# Altium schematic sheet Motherboard.SchDoc
size A4; SheetNumber: 2; SheetTotal: 2
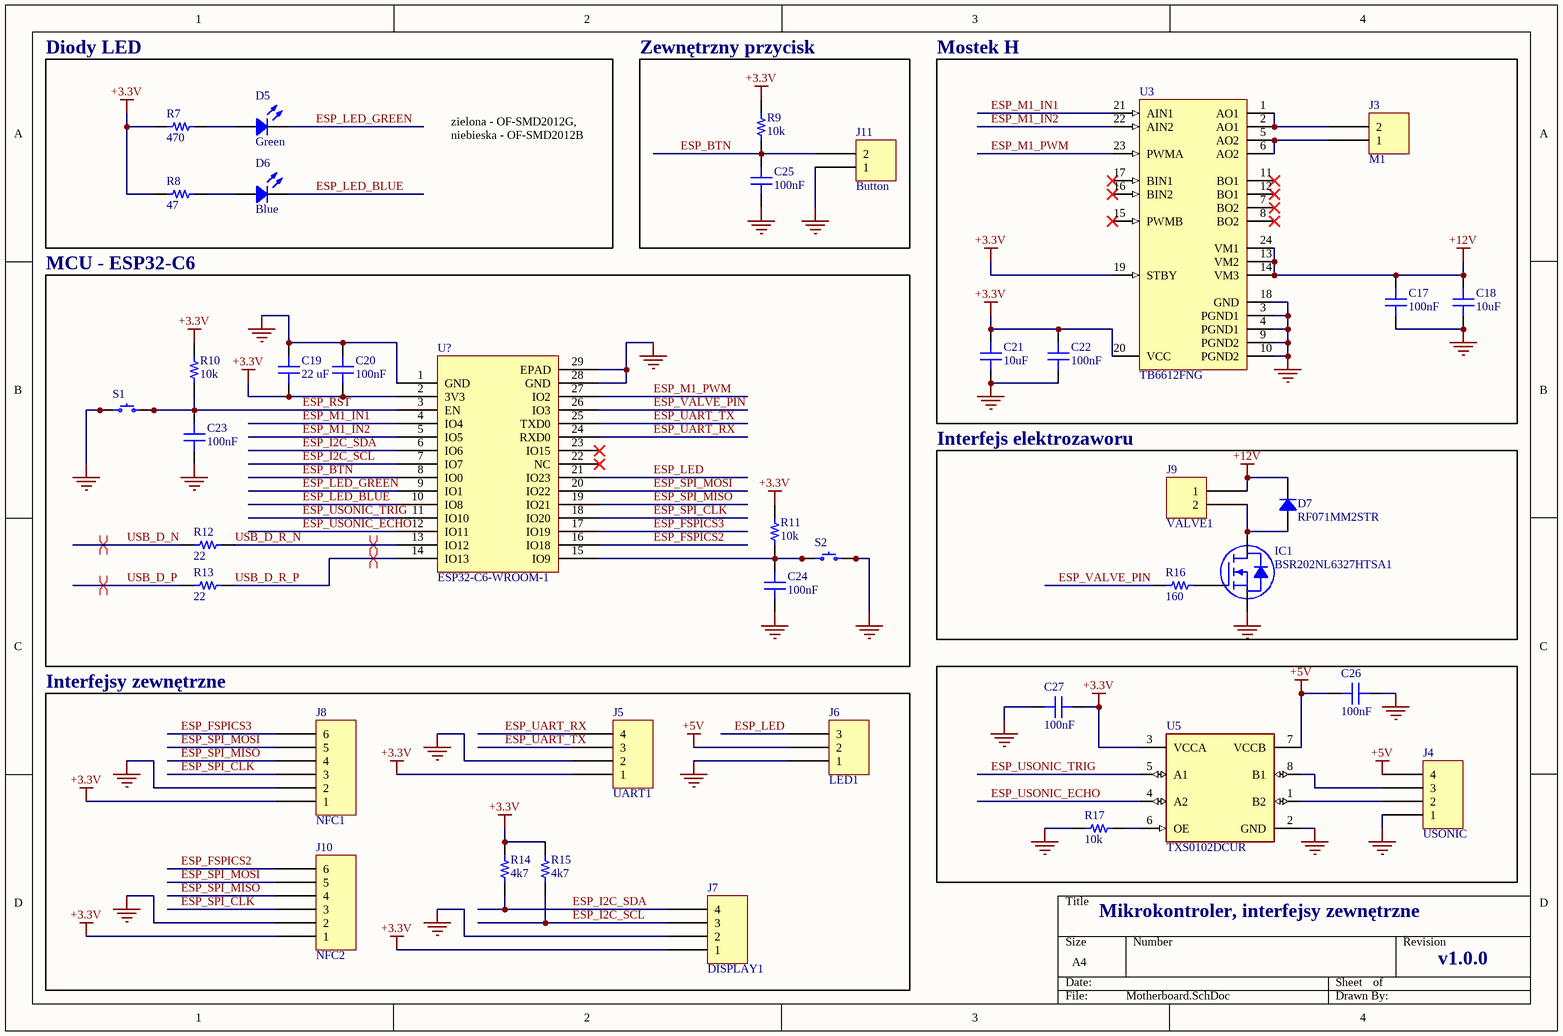
[diagram p0: Motherboard.SchDoc]

## Parts
C17  Capacitance: 100nF  [CAP 0805_2012]  (hidden comment: 0.1 µF)
C18  Capacitance: 10uF  [CAP 0805_2012]  (hidden comment: 10 µF)
C19  Capacitance: 22 uF  [CAP 0805_2012]  (hidden comment: 22 µF)
C20  Capacitance: 100nF  [CAP 0805_2012]  (hidden comment: 0.1 µF)
C21  Capacitance: 10uF  [CAP 0805_2012]  (hidden comment: 10 µF)
C22  Capacitance: 100nF  [CAP 0805_2012]  (hidden comment: 0.1 µF)
C23  Capacitance: 100nF  [CAP 0805_2012]  (hidden comment: 0.1 µF)
C24  Capacitance: 100nF  [CAP 0805_2012]  (hidden comment: 0.1 µF)
C25  Capacitance: 100nF  [CAP 0805_2012]  (hidden comment: 0.1 µF)
C26  Capacitance: 100nF  [CAP 0805_2012]  (hidden comment: 0.1 µF)
C27  Capacitance: 100nF  [CAP 0805_2012]  (hidden comment: 0.1 µF)
D5  Green  [LED 0805_2012 GREEN]
D6  Blue  [LED 0805_2012 BLUE]
D7  RF071MM2STR  [SOD123F]
IC1  BSR202NL6327HTSA1  [INFINEON SOT-23-3]
J3  M1  [MOLEX KK 0022272021]
J4  USONIC  [MOLEX KK 0022272041]
J5  UART1  [MOLEX KK 0022272041]
J6  LED1  [MOLEX KK 0022272031]
J7  DISPLAY1  [MOLEX KK 0022272041]
J8  NFC1  [MOLEX KK 0022272061]
J9  VALVE1  [MOLEX KK 0022272021]
J10  NFC2  [MOLEX KK 0022272061]
J11  Button  [MOLEX KK 0022272021]
R7  470  [RES 0805_2012]
R8  47  [RES 0805_2012]
R9  10k  [RES 0805_2012]
R10  10k  [RES 0805_2012]
R11  10k  [RES 0805_2012]
R12  22  [RES 0805_2012]
R13  22  [RES 0805_2012]
R14  4k7  [RES 0805_2012]
R15  4k7  [RES 0805_2012]
R16  160  [YAGEO RES 0805_2012]
R17  10k  [RES 0805_2012]
S1  FSM6JSMAASTR  [TE FSM6JSMA]  (value not drawn)
S2  FSM6JSMAASTR  [TE FSM6JSMA]  (value not drawn)
U3  TB6612FNG  [TOSH-SSOP-24_M]
U4  ESP32-C6-WROOM-1  [ESP32-C6-WROOM1]
U5  TXS0102DCUR  [FP-DCU0008A-MFG]

## Blocks framed on the sheet
Diody LED: D5 D6 R7 R8
Zewnętrzny przycisk: C25 J11 R9
Mostek H: C17 C18 C21 C22 J3 U3
MCU - ESP32-C6: C19 C20 C23 C24 R10-R13 S1 S2 U4
Interfejs elektrozaworu: D7 IC1 J9 R16
Interfejsy zewnętrzne: J5-J8 J10 R14 R15

## Nets
+3.3V: C19.1 C20.1 C21.2 C22.1 C27.2 J5.1 J7.1 J8.1 J10.1 R7.1 R8.1 R9.2 R10.2 R11.2 R14.2 R15.2 U3.19(STBY) U3.20(VCC) U4.2(3V3) U5.3(VCCA)
+5V: C26.1 J4.4 J6.2 U5.7(VCCB)
+12V: C17.1 C18.2 D7.2 J9.1 U3.13(VM2) U3.14(VM3) U3.24(VM1)
GND: C17.2 C18.1 C19.2 C20.2 C21.1 C22.2 C23.1 C24.1 C25.1 C26.2 C27.1 IC1.2(S) J4.1 J5.2 J6.1 J7.2 J8.2 J10.2 J11.1 R17.1 S1.1 S1.2 S2.3 S2.4 U3.3(PGND1) U3.4(PGND1) U3.9(PGND2) U3.10(PGND2) U3.18(GND) U4.1(GND) U4.28(GND) U4.29(EPAD) U5.2(GND)
ESP_BTN: C25.2 J11.2 R9.1 U4.8(IO0)
ESP_FSPICS2: J10.6 U4.16(IO18)
ESP_FSPICS3: J8.6 U4.17(IO19)
ESP_I2C_SCL: J7.3 R15.1 U4.7(IO7)
ESP_I2C_SDA: J7.4 R14.1 U4.6(IO6)
ESP_LED: J6.3 U4.21(IO23)
ESP_LED_BLUE: D6.2 U4.10(IO8)
ESP_LED_GREEN: D5.2 U4.9(IO1)
ESP_M1_IN1: U3.21(AIN1) U4.4(IO4)
ESP_M1_IN2: U3.22(AIN2) U4.5(IO5)
ESP_M1_PWM: U3.23(PWMA) U4.27(IO2)
ESP_RST: C23.2 R10.1 S1.3 S1.4 U4.3(EN)
ESP_SPI_CLK: J8.3 J10.3 U4.18(IO20)
ESP_SPI_MISO: J8.4 J10.4 U4.19(IO21)
ESP_SPI_MOSI: J8.5 J10.5 U4.20(IO22)
ESP_UART_RX: J5.4 U4.24(RXD0)
ESP_UART_TX: J5.3 U4.25(TXD0)
ESP_USONIC_ECHO: U4.12(IO11) U5.4(A2)
ESP_USONIC_TRIG: U4.11(IO10) U5.5(A1)
ESP_VALVE_PIN: R16.1 U4.26(IO3)
USB_D_N: R12.1
USB_D_P: R13.1
USB_D_R_N: R12.2 U4.13(IO12)
USB_D_R_P: R13.2 U4.14(IO13)
NetC24_2: C24.2 R11.1 S2.1 S2.2 U4.15(IO9)
NetD5_1: D5.1 R7.2
NetD6_1: D6.1 R8.2
NetD7_1: D7.1 IC1.3(D) J9.2
NetIC1_1: IC1.1(G) R16.2
NetJ3_1: J3.1 U3.5(AO2) U3.6(AO2)
NetJ3_2: J3.2 U3.1(AO1) U3.2(AO1)
NetJ4_2: J4.2 U5.1(B2)
NetJ4_3: J4.3 U5.8(B1)
NetR17_2: R17.2 U5.6(OE)

Not connected (* = marked no-connect by the designer): U3 7(BO2)* 8(BO2)* 11(BO1)* 12(BO1)* 15(PWMB)* 16(BIN2)* 17(BIN1)*; U4 22(NC)* 23(IO15)*

## Layout directives
differential pair: USB_D_N, USB_D_P, USB_D_R_N, USB_D_R_P

## Notes on the sheet
- zielona - OF-SMD2012G, niebieska - OF-SMD2012B
- Mikrokontroler, interfejsy zewnętrzne
- v1.0.0
- (in symbol ESP32-C6-WROOM-1) U?

## Library data of the parts
C17 C20 C22-C27 = CC0805MRX7R9BB104: CAP CER 0.1UF 50V X7R 0805; manufacturer: Yageo; Tolerance: ±20%; Part Number: CC0805MRX7R9BB104; Applications: General Purpose; componentlink1description: Datasheet; componentlink1url: https://www.yageo.com/upload/media/product/productsearch/datasheet/mlcc/UPY-GPHC_X7R_6.3V-to-50V_18.pdf; componentlink2description: DigiKey Link; componentlink2url: https://www.digikey.com/en/products/detail/yageo/CC0805MRX7R9BB104/5884281; Device Package: 0805 (2012 Metric); lastupdated: 09/02/2024 20:16:09; Lifecycle Status: Active; Minimum Order: 1; Mounting Type: Surface Mount, MLCC; Operating Temperature: -55°C ~ 125°C; Package / Case: 0805 (2012 Metric); packaging: TapeAndReel; partid: 2475; Part Status: Active; price: 0.01; series: CC; Size / Dimension: 0.079" L x 0.049" W (2.00mm x 1.25mm); Supplier 1: DigiKey; Supplier Part Number 1: 311-4351-1-ND; Temperature Coefficient: X7R; Thickness (Max): 0.037" (0.95mm); value: 0.1 µF; Voltage - Rated: 50V
C18 C21 = C2012X6S1C106K125AC: CAP CER 10UF 16V X6S 0805; manufacturer: TDK Corporation; Tolerance: ±10%; Part Number: C2012X6S1C106K125AC; Applications: General Purpose; componentlink1description: Datasheet; componentlink1url: https://product.tdk.com/info/en/catalog/datasheets/mlcc_commercial_general_en.pdf?ref_disty=digikey; componentlink2description: DigiKey Link; componentlink2url: https://www.digikey.com/en/products/detail/tdk-corporation/C2012X6S1C106K125AC/2733046; Device Package: 0805 (2012 Metric); Features: Low ESL; lastupdated: 09/02/2024 20:16:08; Lifecycle Status: Active; Minimum Order: 1; Mounting Type: Surface Mount, MLCC; Operating Temperature: -55°C ~ 105°C; Package / Case: 0805 (2012 Metric); packaging: TapeAndReel; partid: 2995; Part Status: Active; price: 0.06; series: C; Size / Dimension: 0.079" L x 0.049" W (2.00mm x 1.25mm); Supplier 1: DigiKey; Supplier Part Number 1: 445-7611-1-ND; Temperature Coefficient: X6S; Thickness (Max): 0.057" (1.45mm); value: 10 µF; Voltage - Rated: 16V
C19 = CL21A226KOQNNNG: CAP CER 22UF 16V X5R 0805; manufacturer: Samsung Electro-Mechanics; Tolerance: ±10%; Part Number: CL21A226KOQNNNG; Applications: General Purpose; componentlink1description: Datasheet; componentlink1url: //media.digikey.com/pdf/Data%20Sheets/Samsung%20PDFs/CL21A226KOQNNNG_Spec.pdf; componentlink2description: DigiKey Link; componentlink2url: https://www.digikey.com/en/products/detail/samsung-electro-mechanics/CL21A226KOQNNNG/3894433; Device Package: 0805 (2012 Metric); lastupdated: 09/02/2024 20:16:07; Lifecycle Status: Active; Minimum Order: 1; Mounting Type: Surface Mount, MLCC; Operating Temperature: -55°C ~ 85°C; Package / Case: 0805 (2012 Metric); packaging: TapeAndReel; partid: 3000; Part Status: Active; price: 0.06; series: CL; Size / Dimension: 0.079" L x 0.049" W (2.00mm x 1.25mm); Supplier 1: DigiKey; Supplier Part Number 1: 1276-7092-1-ND; Temperature Coefficient: X5R; Thickness (Max): 0.055" (1.40mm); value: 22 µF; Voltage - Rated: 16V
D5 = APHCM2012CGCK-F01: LED GREEN CLEAR CHIP SMD; Manufacturer: Kingbright; Configuration: Standard; Current - Test: 20mA; Lens Color: Colorless; Lens Size: 1.30mm x 1.25mm; Lens Style: Rectangle with Flat Top; Millicandela Rating: 50mcd; Viewing Angle: 110°; Voltage - Forward (Vf) (Typ): 2.1V; Wavelength - Dominant: 570nm; Wavelength - Peak: 574nm; Part Number: APHCM2012CGCK-F01; Color: Green; ComponentLink1Description: Datasheet; ComponentLink1URL: http://www.kingbrightusa.com/images/catalog/SPEC/APHCM2012CGCK-F01.pdf; ComponentLink2Description: DigiKey Link; ComponentLink2URL: https://www.digikey.com/en/products/detail/kingbright/APHCM2012CGCK-F01/1747492; Device Package: 0805 (2012 Metric); Height (Max): 0.40mm; LastUpdated: 03/06/2024 20:00:30; Lens Transparency: Clear; Lifecycle Status: Active; Minimum Order: 1; Mounting Type: Surface Mount; Package / Case: 0805 (2012 Metric); Packaging: TapeAndReel; PartId: 241; Part Status: Active; Price: 0.05; Series: -; Size / Dimension: 2.00mm L x 1.25mm W; Supplier 1: DigiKey; Supplier Part Number 1: 754-1094-1-ND; Supplier Device Package: Chip LED; Value: Green
D6 = SMLMN2BCTT86C: LED BLUE CLEAR 2012 SMD; Manufacturer: Rohm Semiconductor; Configuration: Standard; Current - Test: 5mA; Lens Color: Colorless; Lens Size: 1.40mm x 0.85mm; Lens Style: Rectangle with Flat Top; Millicandela Rating: 36mcd; Voltage - Forward (Vf) (Typ): 2.9V; Wavelength - Dominant: 470nm; Part Number: SMLMN2BCTT86C; Color: Blue; ComponentLink1Description: Datasheet; ComponentLink1URL: https://www.rohm.com/datasheet/SML-M13UT; ComponentLink2Description: DigiKey Link; ComponentLink2URL: https://www.digikey.com/en/products/detail/rohm-semiconductor/SMLMN2BCTT86C/6057236; Device Package: 0805 (2012 Metric); Height (Max): 0.90mm; LastUpdated: 03/06/2024 19:58:02; Lens Transparency: Clear; Lifecycle Status: Active; Minimum Order: 1; Mounting Type: Surface Mount; Package / Case: 0805 (2012 Metric); Packaging: TapeAndReel; PartId: 754; Part Status: Active; Price: 0.12; Series: -; Size / Dimension: 2.00mm L x 1.25mm W; Supplier 1: DigiKey; Supplier Part Number 1: 846-1207-1-ND; Supplier Device Package: 2012(0805); Value: Blue
D7 = RF071MM2STR: DIODE GEN PURP 200V 700MA PMDU; Manufacturer: Rohm Semiconductor; Current - Reverse Leakage @ Vr: 10 µA @ 200 V; Diode Type: Standard; Reverse Recovery Time (trr): 25 ns; Speed: Fast Recovery =< 500ns, > 200mA (Io); Voltage - Forward (Vf) (Max) @ If: 850 mV @ 700 mA; Part Number: RF071MM2STR; ComponentLink1Description: Datasheet; ComponentLink1URL: https://www.rohm.com/datasheet/RF071MM2S/rf071mm2s-e; ComponentLink2Description: DigiKey Link; ComponentLink2URL: https://www.digikey.com/en/products/detail/rohm-semiconductor/RF071MM2STR/5001870; Current - Average Rectified (Io): 700mA; LastUpdated: 03/06/2024 19:54:58; Lifecycle Status: Active; Minimum Order: 1; Mounting Type: Surface Mount; Operating Temperature - Junction: 150°C (Max); Package / Case: SOD-123F; Packaging: TapeAndReel; PartId: 1071; Part Status: Active; Price: 0.08; Series: -; Supplier 1: DigiKey; Supplier Part Number 1: RF071MM2SCT-ND; Supplier Device Package: PMDU; Voltage - DC Reverse (Vr) (Max): 200 V
IC1 = BSR202NL6327HTSA1: MOSFET N-CH 20V 3.8A SC59; Manufacturer: Infineon Technologies; Current - Continuous Drain (Id) @ 25°C: 3.8A (Ta); Drive Voltage (Max Rds On,  Min Rds On): 2.5V, 4.5V; FET Type: N-Channel; Gate Charge (Qg) (Max) @ Vgs: 8.8 nC @ 4.5 V; Input Capacitance (Ciss) (Max) @ Vds: 1147 pF @ 10 V; Power Dissipation (Max): 500mW (Ta); Rds On (Max) @ Id, Vgs: 21mOhm @ 3.8A, 4.5V; Vgs (Max): ±12V; Vgs(th) (Max) @ Id: 1.2V @ 30µA; Part Number: BSR202NL6327HTSA1; ComponentLink1Description: Datasheet; ComponentLink1URL: https://www.infineon.com/dgdl/BSR202N_Rev1.06.pdf?folderId=db3a3043156fd573011622e10b5c1f67&fileId=db3a3043156fd573011622e5576e1f72; ComponentLink2Description: DigiKey Link; ComponentLink2URL: https://www.digikey.com/en/products/detail/infineon-technologies/BSR202NL6327HTSA1/2080702; Drain to Source Voltage (Vdss): 20 V; LastUpdated: 03/06/2024 20:15:23; Lifecycle Status: Active; Minimum Order: 1; Mounting Type: Surface Mount; Operating Temperature: -55°C ~ 150°C (TJ); Package / Case: TO-236-3, SC-59, SOT-23-3; Packaging: TapeAndReel; Part Status: Active; Price: 0.15; Series: OptiMOS™; Supplier 1: DigiKey; Supplier Part Number 1: BSR202NL6327HTSA1CT-ND; Supplier Device Package: PG-SC59-3; Technology: MOSFET (Metal Oxide)
J3 J9 J11 = 0022272021: CONN HEADER VERT 2POS 2.54MM; Manufacturer: Molex; Contact Length - Mating: 0.295" (7.49mm); Contact Length - Post: 0.140" (3.56mm); Material Flammability Rating: UL94 V-0; Number of Positions: 2; Number of Positions Loaded: All; Overall Contact Length: 0.560" (14.22mm); Pitch - Mating: 0.100" (2.54mm); Shrouding: Shrouded - 1 Wall; Style: Board to Cable/Wire; Part Number: 0022272021; ComponentLink1Description: Datasheet; ComponentLink1URL: https://www.molex.com/pdm_docs/sd/022272021_sd.pdf; ComponentLink2Description: DigiKey Link; ComponentLink2URL: http://digikey.com/product-detail/en/molex/0022272021/WM4111-ND/1130577; Connector Type: Header; Contact Finish - Mating: Tin; Contact Finish - Post: Tin; Contact Finish Thickness - Mating: 100.0µin (2.54µm); Contact Material: Brass; Contact Shape: Square; Contact Type: Male Pin; Fastening Type: Friction Lock; Insulation Color: Natural; Insulation Height: 0.461" (11.70mm); Insulation Material: Polyamide (PA), Nylon; LastUpdated: 12/01/2020 23:51:43; Lifecycle Status: Active; Minimum Order: 1; Mounting Type: Through Hole; Number of Rows: 1; Packaging: Bulk; PartId: 76; Part Status: Active; Price: 0.27; Series: KK 6410; Supplier 1: DigiKey; Supplier Part Number 1: WM4111-ND; Termination: Solder
J4 J5 J7 = 0022272041: CONN HEADER VERT 4POS 2.54MM; Manufacturer: Molex; Contact Length - Mating: 0.295" (7.49mm); Contact Length - Post: 0.140" (3.56mm); Material Flammability Rating: UL94 V-0; Number of Positions: 4; Number of Positions Loaded: All; Overall Contact Length: 0.560" (14.22mm); Pitch - Mating: 0.100" (2.54mm); Shrouding: Shrouded - 1 Wall; Style: Board to Cable/Wire; Part Number: 0022272041; ComponentLink1Description: Datasheet; ComponentLink1URL: https://www.molex.com/pdm_docs/sd/022272041_sd.pdf; ComponentLink2Description: DigiKey Link; ComponentLink2URL: http://digikey.com/product-detail/en/molex/0022272041/WM4113-ND/1130579; Connector Type: Header; Contact Finish - Mating: Tin; Contact Finish - Post: Tin; Contact Finish Thickness - Mating: 100.0µin (2.54µm); Contact Material: Brass; Contact Shape: Square; Contact Type: Male Pin; Fastening Type: Friction Lock; Insulation Color: Natural; Insulation Height: 0.461" (11.70mm); Insulation Material: Polyamide (PA), Nylon; LastUpdated: 12/01/2020 23:52:05; Lifecycle Status: Active; Minimum Order: 1; Mounting Type: Through Hole; Number of Rows: 1; Packaging: Bulk; PartId: 78; Part Status: Active; Price: 0.40; Series: KK 6410; Supplier 1: DigiKey; Supplier Part Number 1: WM4113-ND; Termination: Solder
J6 = 0022272031: CONN HEADER VERT 3POS 2.54MM; Manufacturer: Molex; Contact Length - Mating: 0.295" (7.49mm); Contact Length - Post: 0.140" (3.56mm); Material Flammability Rating: UL94 V-0; Number of Positions: 3; Number of Positions Loaded: All; Overall Contact Length: 0.560" (14.22mm); Pitch - Mating: 0.100" (2.54mm); Shrouding: Shrouded - 1 Wall; Style: Board to Cable/Wire; Part Number: 0022272031; ComponentLink1Description: Datasheet; ComponentLink1URL: https://www.molex.com/pdm_docs/sd/022272031_sd.pdf; ComponentLink2Description: DigiKey Link; ComponentLink2URL: http://digikey.com/product-detail/en/molex/0022272031/WM4112-ND/1130578; Connector Type: Header; Contact Finish - Mating: Tin; Contact Finish - Post: Tin; Contact Finish Thickness - Mating: 100.0µin (2.54µm); Contact Material: Brass; Contact Shape: Square; Contact Type: Male Pin; Fastening Type: Friction Lock; Insulation Color: Natural; Insulation Height: 0.461" (11.70mm); Insulation Material: Polyamide (PA), Nylon; LastUpdated: 12/01/2020 23:51:54; Lifecycle Status: Active; Minimum Order: 1; Mounting Type: Through Hole; Number of Rows: 1; Packaging: Bulk; PartId: 77; Part Status: Active; Price: 0.37; Series: KK 6410; Supplier 1: DigiKey; Supplier Part Number 1: WM4112-ND; Termination: Solder
J8 J10 = 0022272061: CONN HEADER VERT 6POS 2.54MM; Manufacturer: Molex; Contact Length - Mating: 0.295" (7.49mm); Contact Length - Post: 0.140" (3.56mm); Material Flammability Rating: UL94 V-0; Number of Positions: 6; Number of Positions Loaded: All; Overall Contact Length: 0.560" (14.22mm); Pitch - Mating: 0.100" (2.54mm); Shrouding: Shrouded - 1 Wall; Style: Board to Cable/Wire; Part Number: 0022272061; ComponentLink1Description: Datasheet; ComponentLink1URL: https://www.molex.com/pdm_docs/sd/022272061_sd.pdf; ComponentLink2Description: DigiKey Link; ComponentLink2URL: http://digikey.com/product-detail/en/molex/0022272061/WM4115-ND/1130581; Connector Type: Header; Contact Finish - Mating: Tin; Contact Finish - Post: Tin; Contact Finish Thickness - Mating: 100.0µin (2.54µm); Contact Material: Brass; Contact Shape: Square; Contact Type: Male Pin; Fastening Type: Friction Lock; Insulation Color: Natural; Insulation Height: 0.461" (11.70mm); Insulation Material: Polyamide (PA), Nylon; LastUpdated: 12/01/2020 23:52:24; Lifecycle Status: Active; Minimum Order: 1; Mounting Type: Through Hole; Number of Rows: 1; Packaging: Bulk; PartId: 80; Part Status: Active; Price: 0.49; Series: KK 6410; Supplier 1: DigiKey; Supplier Part Number 1: WM4115-ND; Termination: Solder
R7 = CRGP0805F470R: RES 470 OHM 1% 1/3W 0805; Manufacturer: TE Connectivity Passive Product; Power (Watts): 0.333W, 1/3W; Resistance: 470 Ohms; Temperature Coefficient: ±100ppm/°C; Part Number: CRGP0805F470R; Value: 470; ComponentLink1Description: Datasheet; ComponentLink1URL: https://www.te.com/commerce/DocumentDelivery/DDEController?Action=srchrtrv&DocNm=9-1773463-9&DocType=DS&DocLang=English; ComponentLink2Description: DigiKey Link; ComponentLink2URL: https://www.digikey.com/en/products/detail/te-connectivity-passive-product/CRGP0805F470R/8577075; Composition: Thick Film; Device Package: 0805 (2012 Metric); Features: Pulse Withstanding; Height - Seated (Max): 0.026" (0.65mm); LastUpdated: 08/02/2024 21:02:34; Lifecycle Status: Active; Minimum Order: 1; Number of Terminations: 2; Operating Temperature: -55°C ~ 155°C; Package / Case: 0805 (2012 Metric); Packaging: TapeAndReel; PartId: 28801; Part Status: Active; Price: 0.02; Series: CRGP; Size / Dimension: 0.079" L x 0.049" W (2.00mm x 1.25mm); Supplier 1: DigiKey; Supplier Part Number 1: A130473CT-ND; Supplier Device Package: 0805; Tolerance: ±1%
R8 = CRGP0805F47R: RES 47 OHM 1% 1/3W 0805; Manufacturer: TE Connectivity Passive Product; Power (Watts): 0.333W, 1/3W; Resistance: 47 Ohms; Temperature Coefficient: ±100ppm/°C; Part Number: CRGP0805F47R; Value: 47; ComponentLink1Description: Datasheet; ComponentLink1URL: https://www.te.com/commerce/DocumentDelivery/DDEController?Action=srchrtrv&DocNm=9-1773463-9&DocType=DS&DocLang=English; ComponentLink2Description: DigiKey Link; ComponentLink2URL: https://www.digikey.com/en/products/detail/te-connectivity-passive-product/CRGP0805F47R/8577063; Composition: Thick Film; Device Package: 0805 (2012 Metric); Features: Pulse Withstanding; Height - Seated (Max): 0.026" (0.65mm); LastUpdated: 08/02/2024 21:02:34; Lifecycle Status: Active; Minimum Order: 1; Number of Terminations: 2; Operating Temperature: -55°C ~ 155°C; Package / Case: 0805 (2012 Metric); Packaging: TapeAndReel; PartId: 28763; Part Status: Active; Price: 0.02; Series: CRGP; Size / Dimension: 0.079" L x 0.049" W (2.00mm x 1.25mm); Supplier 1: DigiKey; Supplier Part Number 1: A130461CT-ND; Supplier Device Package: 0805; Tolerance: ±1%
R9-R11 R17 = RNCS0805BKE10K0: RES 10K OHM 0.1% 1/10W 0805; Manufacturer: Stackpole Electronics Inc; Power (Watts): 0.1W, 1/10W; Resistance: 10 kOhms; Temperature Coefficient: ±25ppm/°C; Part Number: RNCS0805BKE10K0; Value: 10k; ComponentLink1Description: Datasheet; ComponentLink1URL: https://www.seielect.com/catalog/sei-rncs_rnch.pdf; ComponentLink2Description: DigiKey Link; ComponentLink2URL: https://www.digikey.com/en/products/detail/stackpole-electronics-inc/RNCS0805BKE10K0/1800067; Composition: Thin Film; Device Package: 0805 (2012 Metric); Features: Anti-Corrosive, Automotive AEC-Q200, Moisture Resistant; Height - Seated (Max): 0.026" (0.65mm); LastUpdated: 08/02/2024 21:02:39; Lifecycle Status: Active; Minimum Order: 1; Number of Terminations: 2; Operating Temperature: -55°C ~ 155°C; Package / Case: 0805 (2012 Metric); Packaging: TapeAndReel; PartId: 27713; Part Status: Active; Price: 0.07; Ratings: AEC-Q200; Series: RNCS; Size / Dimension: 0.079" L x 0.049" W (2.00mm x 1.25mm); Supplier 1: DigiKey; Supplier Part Number 1: RNCS0805BKE10K0CT-ND; Supplier Device Package: 0805; Tolerance: ±0.1%
R12 R13 = CPF0805B22RE1: RES SMD 22 OHM 0.1% 1/10W 0805; Manufacturer: TE Connectivity Passive Product; Power (Watts): 0.1W, 1/10W; Resistance: 22 Ohms; Temperature Coefficient: ±25ppm/°C; Part Number: CPF0805B22RE1; Value: 22; ComponentLink1Description: Datasheet; ComponentLink1URL: https://www.te.com/commerce/DocumentDelivery/DDEController?Action=srchrtrv&DocNm=1773200&DocType=DS&DocLang=English; ComponentLink2Description: DigiKey Link; ComponentLink2URL: https://www.digikey.com/en/products/detail/te-connectivity-passive-product/CPF0805B22RE1/2381993; Composition: Thin Film; Device Package: 0805 (2012 Metric); Height - Seated (Max): 0.026" (0.65mm); LastUpdated: 08/02/2024 21:02:36; Lifecycle Status: Active; Minimum Order: 1; Number of Terminations: 2; Operating Temperature: -55°C ~ 155°C; Package / Case: 0805 (2012 Metric); Packaging: TapeAndReel; PartId: 28451; Part Status: Active; Price: 0.12; Series: CPF, Neohm; Size / Dimension: 0.079" L x 0.049" W (2.00mm x 1.25mm); Supplier 1: DigiKey; Supplier Part Number 1: A103179CT-ND; Supplier Device Package: 0805; Tolerance: ±0.1%
R14 R15 = RCS08054K70JNEA: RES SMD 4.7K OHM 5% 1/2W 0805; Manufacturer: Vishay Dale; Power (Watts): 0.5W, 1/2W; Resistance: 4.7 kOhms; Temperature Coefficient: ±200ppm/°C; Part Number: RCS08054K70JNEA; Value: 4k7; ComponentLink1Description: Datasheet; ComponentLink1URL: http://www.vishay.com/docs/20065/rcse3.pdf; ComponentLink2Description: DigiKey Link; ComponentLink2URL: https://www.digikey.com/en/products/detail/vishay-dale/RCS08054K70JNEA/5867012; Composition: Thick Film; Device Package: 0805 (2012 Metric); Features: Automotive AEC-Q200, Pulse Withstanding; Height - Seated (Max): 0.020" (0.50mm); LastUpdated: 08/02/2024 21:02:38; Lifecycle Status: Active; Minimum Order: 1; Number of Terminations: 2; Operating Temperature: -55°C ~ 155°C; Package / Case: 0805 (2012 Metric); Packaging: TapeAndReel; PartId: 27839; Part Status: Active; Price: 0.02; Ratings: AEC-Q200; Series: RCS e3; Size / Dimension: 0.079" L x 0.049" W (2.00mm x 1.25mm); Supplier 1: DigiKey; Supplier Part Number 1: 541-2866-1-ND; Supplier Device Package: 0805; Tolerance: ±5%
R16 = RT0805BRD07160RL: RES SMD 160 OHM 0.1% 1/8W 0805; Manufacturer: Yageo; Power (Watts): 0.125W, 1/8W; Resistance: 160 Ohms; Temperature Coefficient: ±25ppm/°C; Part Number: RT0805BRD07160RL; Value: 160; ComponentLink1Description: Datasheet; ComponentLink1URL: https://www.yageo.com/upload/media/product/productsearch/datasheet/rchip/PYu-RT_1-to-0.01_RoHS_L_11.pdf; ComponentLink2Description: DigiKey Link; ComponentLink2URL: https://www.digikey.com/en/products/detail/yageo/RT0805BRD07160RL/1075624; Composition: Thin Film; Device Package: 0805 (2012 Metric); Height - Seated (Max): 0.024" (0.60mm); LastUpdated: 25/07/2024 09:20:24; Lifecycle Status: Active; Minimum Order: 1; Number of Terminations: 2; Operating Temperature: -55°C ~ 155°C; Package / Case: 0805 (2012 Metric); Packaging: TapeAndReel; PartId: 33619; Part Status: Active; Price: 0.04; Series: RT; Size / Dimension: 0.079" L x 0.049" W (2.00mm x 1.25mm); Supplier 1: DigiKey; Supplier Part Number 1: YAG1789CT-ND; Supplier Device Package: 0805; Tolerance: ±0.1%
S1 S2 = FSM6JSMAASTR: SWITCH TACTILE SPST-NO 0.05A 24V; Manufacturer: TE Connectivity ALCOSWITCH Switches; Actuator Height off PCB, Vertical: 7.00mm; Actuator Orientation: Top Actuated; Actuator Type: Standard; Contact Rating @ Voltage: 0.05A @ 24VDC; Illumination: Non-Illuminated; Operating Force: 260gf; Outline: 6.00mm x 6.00mm; Switch Function: Off-Mom; Part Number: FSM6JSMAASTR; Circuit: SPST-NO; ComponentLink1Description: Datasheet; ComponentLink1URL: https://www.te.com/commerce/DocumentDelivery/DDEController?Action=srchrtrv&DocNm=1308111-1_SWITCHES_CORE_PROGRAM_CATALOG&DocType=CS&DocLang=English; ComponentLink2Description: DigiKey Link; ComponentLink2URL: https://www.digikey.com/en/products/detail/te-connectivity-alcoswitch-switches/FSM6JSMAASTR/5343804; LastUpdated: 03/06/2024 20:19:31; Lifecycle Status: Active; Minimum Order: 1; Mounting Type: Surface Mount; Operating Temperature: -40°C ~ 105°C; Packaging: TapeAndReel; Part Status: Active; Price: 0.30; Series: FSMJSMA; Supplier 1: DigiKey; Supplier Part Number 1: 450-2138-1-ND; Termination Style: Gull Wing
U3 = CMP-1773-00001-1: Driver IC for Dual DC Motor, 15 V, -20 to 85 degC, 24-Pin SSOP, RoHS, Tape and Reel; Elements: 2; Max Power Dissipation: 200 mW; Max Surge Current: 100 mA; Element Configuration: Common Cathode; Case\Package: TO-236-3; Forward Voltage: 1 V; Peak Reverse Current: 0.1 uA; Forward Current: 70 mA; Recovery Time: 5 ns; Radiation Hardening: No; Packaging: Tape and Reel; ComponentLink2Description: Datasheet; REACH SVHC: No SVHC; ComponentLink2URL: https://toshiba.semicon-storage.com/info/docget.jsp?did=10660&prodName=TB6612FNG; RoHSCompliant: true; DatasheetVersion: Oct-14; PackageDescription: 24-Pin Shrink Small Outline Package Integrated Circuit, Body 7.8 x 5.6 mm, Pitch 0.65 mm; Package Quantity: 3000; Length: 3 mm; Pins: 3; Mount: Surface Mount; ComponentLink1Description: Manufacturer URL; PackageReference: SSOP-24; ComponentLink1URL: http://www.toshiba.com/; Width: 1.4 mm; Max Operating Temperature: 125 degC; Height: 1.1 mm; Min Operating Temperature: -55 degC
U5 = CMP-0859-00001-2: IC TRNSLTR BIDIRECTIONAL US8; Manufacturer: Texas Instruments; Number Of Circuits: 1; Number Of Inputs: 2; Data Rate: 24Mbits/s; Max Junction Temp: +150°C; V A Min: 1.65V; Standoff Height: 0mm; Logic Function Desc: Bidirectional Voltage-Level Translator; Max Supply Voltage: 5.5V; Description: TXS0102 2-Bit Bidirectional Voltage-Level Translator for Open-Drain and Push-Pull Applications; V A Max: 3.6V; Nominal Supply Current: 1-14.4uA; V B Min: 2.3V; Temperature: -40°C to +85°C; Temperature Range Low: -40°C; Height: 0.9mm; Device Class L1: Integrated Circuits (ICs); RoHS: TRUE; Min Supply Voltage: 1.65V; Digikey Description: IC TRNSLTR BIDIRECTIONAL US8; ComponentLink2Description: Datasheet; Octopart: https://octopart.com/txs0102dcur-texas+instruments-5414308; Temperature Range High: +85°C; Device Class L2: Logic ICs; Category: IC; Ambient Temperature Range High: +85°C; Automotive: No; Manufacturer Part Number: TXS0102DCUR; Device Class L3: Voltage Level Shifters; Number Of Outputs: 2; Ambient Temperature Range Low: -40°C; Lead Free: Yes; ComponentLink2URL: http://www.ti.com/lit/ds/symlink/txs0102.pdf; V B Max: 5.5V; Package: DCU0008A; Mouser Description: Translation - Voltage Levels 2-Bit Bi-Directional Voltage-Level-Trans